# Altium schematic sheet 100_Motor_Mosfet_RGB.SchDoc
size A; SheetNumber: 3; SheetTotal: 4
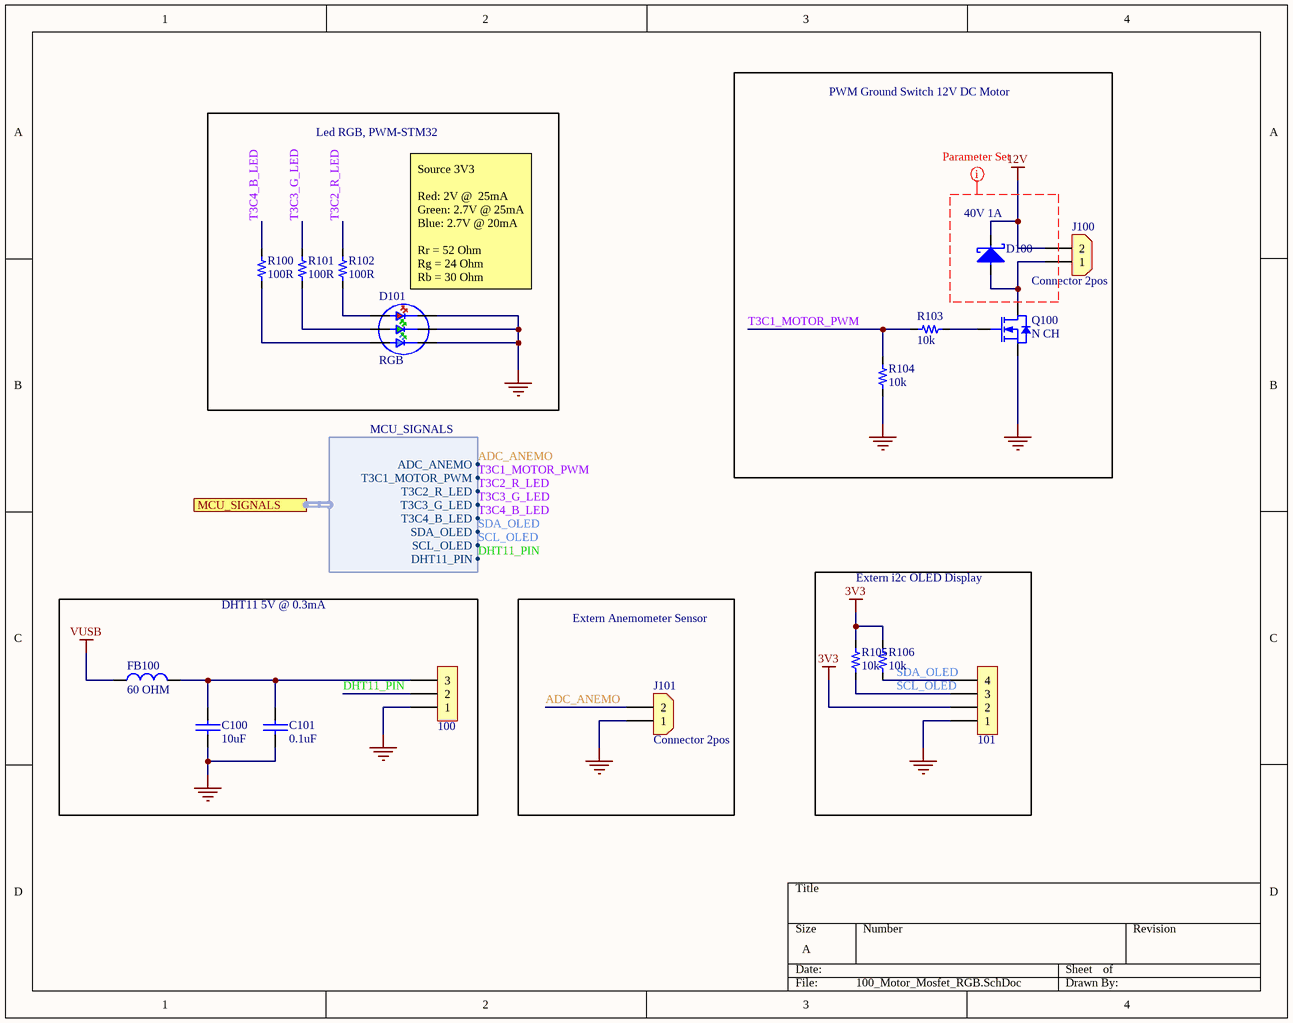
[diagram p0: 100_Motor_Mosfet_RGB.SchDoc]

## Parts
100  3x1  [H_3X1_TH_100mil]  (value not drawn)  (no BOM)
101  4x1  [H_4x1_TH_2.54mm]  (value not drawn)  (no BOM)
C100  value 10uF  [0805_cap]  (hidden comment: 10uF 25V)
C101  value 0.1uF  [0603_cap]  (hidden comment: 0.1uF 50V)
D100  40V 1A  [SOD_123]
D101  RGB  [RGB_NS_3.5X3.7]
FB100  value 60 OHM  [0603_fb]  (hidden comment: 60OHM 2A)
J100  Connector 2pos  [CON_2x1_TH_5MM]
J101  Connector 2pos  [CON_2x1_TH_5MM]
Q100  N CH  [SOT_23_3]
R100  value 100R  [0603_res]  (hidden comment: 100R 1/10W)
R101  value 100R  [0603_res]  (hidden comment: 100R 1/10W)
R102  value 100R  [0603_res]  (hidden comment: 100R 1/10W)
R103  value 10k  [0603_res]  (hidden comment: 10k 1/10W)
R104  value 10k  [0603_res]  (hidden comment: 10k 1/10W)
R105  value 10k  [0603_res]  (hidden comment: 10k 1/10W)
R106  value 10k  [0603_res]  (hidden comment: 10k 1/10W)

## Blocks framed on the sheet
PWM Ground Switch 12V DC Motor: D100 J100 Q100 R103 R104
Led RGB, PWM-STM32: D101 R100-R102
DHT11 5V @ 0.3mA: 100 C100 C101 FB100
Extern Anemometer Sensor: J101
Extern i2c OLED Display: 101 R105 R106

## Ports
MCU_SIGNALS (harness MCU_SIGNALS, see Main[3A], 000_MCUs[2D])

## Harnesses
MCU_SIGNALS: ADC_ANEMO, T3C1_MOTOR_PWM, T3C2_R_LED, T3C3_G_LED, T3C4_B_LED, SDA_OLED, SCL_OLED, DHT11_PIN

## Nets
3V3: 101.2 R105.2 R106.2
12V: D100.1 J100.2
GND: 100.1 101.1 C100.2 C101.2 D101.1 D101.2 D101.3 J101.1 Q100.2(S) R104.1
VUSB: FB100.1
ADC_ANEMO: J101.2 ; port MCU_SIGNALS.ADC_ANEMO
DHT11_PIN: 100.2 ; port MCU_SIGNALS.DHT11_PIN
SCL_OLED: 101.3 R105.1 ; port MCU_SIGNALS.SCL_OLED
SDA_OLED: 101.4 R106.1 ; port MCU_SIGNALS.SDA_OLED
T3C1_MOTOR_PWM: R103.2 R104.2 ; port MCU_SIGNALS.T3C1_MOTOR_PWM
T3C2_R_LED: R102.2 ; port MCU_SIGNALS.T3C2_R_LED
T3C3_G_LED: R101.2 ; port MCU_SIGNALS.T3C3_G_LED
T3C4_B_LED: R100.2 ; port MCU_SIGNALS.T3C4_B_LED
Net100_3: 100.3 C100.1 C101.1 FB100.2
NetD100_2: D100.2 J100.1 Q100.3(D)
NetD101_4: D101.4 R102.1
NetD101_5: D101.5 R101.1
NetD101_6: D101.6 R100.1
NetQ100_1: Q100.1(G) R103.1

## Layout directives
net class 12V_2A: (no net found under the mark)

## Notes on the sheet
- (near D101) Source 3V3
  Red: 2V @  25mA
  Green: 2.7V @ 25mA
  Blue: 2.7V @ 20mA
  Rr = 52 Ohm
  Rg = 24 Ohm
  Rb = 30 Ohm

## Library data of the parts
100 = H_Male_3x1_TH_100mil: ComponentLink1Description: LCSC
101 = H_Male_4x1_TH_100mil: ComponentLink1Description: LCSC
C100 = Cap_10uF_0805_25V_: 25V 10uF X5R ±10% 0805 Multilayer Ceramic Capacitors MLCC - SMD/SMT ROHS; Manufacturer: Samsung Electro-Mechanics; Manufacturer Part Number: CL21A106KAYNNNE; Supplier 1: LCSC; Supplier Part Number 1: C15850; ComponentLink1Description: LCSC; ComponentLink1URL: https://lcsc.com/product-detail/Multilayer-Ceramic-Capacitors-MLCC-SMD-SMT_Samsung-Electro-Mechanics-CL21A106KAYNNNE_C15850.html
C101 = Cap_0.1uF_0603_50V: 50V 100nF Y5V -20%~+80% 0603 Multilayer Ceramic Capacitors MLCC - SMD/SMT ROHS; Manufacturer: Walsin Tech Corp; Manufacturer Part Number: 0603F104Z500CT; Supplier 1: LCSC; Supplier Part Number 1: C83060; ComponentLink1Description: LCSC; ComponentLink1URL: https://www.lcsc.com/product-detail/Multilayer-Ceramic-Capacitors-MLCC-SMD-SMT_Walsin-Tech-Corp-0603F104Z500CT_C83060.html
D100 = D_Schottky_40V_1A_SOD_123F: DIODE SCHOTTKY 40V 1A SOD123F; Manufacturer: Shanghai Prisemi Elec; Manufacturer Part Number: PSBD1DF40V1H; Supplier 1: LCSC; Supplier Part Number 1: C110730; ComponentLink1Description: LCSC; ComponentLink1URL: https://www.lcsc.com/product-detail/Switching-Diode_Shanghai-Prisemi-Elec-PSBD1DF40V1H_C110730.html
D101 = LED_RGB_3535_SMD: -30℃~+85℃ RGB 110° 3535(mm) Light Emitting Diodes (LED) ROHS; Manufacturer: Foshan NationStar Optoelectronics; Manufacturer Part Number: RS-3535MWAM; Supplier 1: LCSC; Supplier Part Number 1: C842778; ComponentLink1Description: LCSC; ComponentLink1URL: https://www.lcsc.com/product-detail/Light-Emitting-Diodes-LED_Foshan-NationStar-Optoelectronics-RS-3535MWAM_C842778.html
FB100 = FB_60_0603_2A: 2A 1 100mΩ 60Ω@100MHz ±25% 0603 Ferrite Beads ROHS; Manufacturer: TAI-TECH; Manufacturer Part Number: HCB1608KF-600T20; ComponentLink1Description: LCSC; ComponentLink1URL: https://www.lcsc.com/product-detail/Ferrite-Beads_TAI-TECH-HCB1608KF-600T20_C369516.html; Supplier 1: LCSC; Supplier Part Number 1: C369516
J100 J101 = Con_2x1_TH_5mm: 2POS 5MM; Manufacturer: JILN; Manufacturer Part Number: JL126-50002G01; Supplier 1: LCSC; Supplier Part Number 1: C394556; ComponentLink1Description: Digi-Key; ComponentLink1URL: https://www.lcsc.com/product-detail/Screw-terminal_JILN-JL126-50002G01_C394556.html
Q100 = Q_NFET_20V_3.2A_SOT23: MOSFET N-CH 20V SOT23; Manufacturer: Doeshare; Manufacturer Part Number: DN2302S; Supplier 1: LCSC; Supplier Part Number 1: C2931750; ComponentLink1Description: LCSC; ComponentLink1URL: https://www.lcsc.com/product-detail/MOSFETs_Doeshare-DN2302S_C2931750.html
R100-R102 = Res_100R_0603_1/10W: RES SMD 100R OHM 5% 1/10W 0603; Manufacturer: FOJAN; Manufacturer Part Number: FRC0603J101 TS; ComponentLink1URL: https://www.lcsc.com/product-detail/Chip-Resistor-Surface-Mount_FOJAN-FRC0603J101-TS_C2907089.html; Supplier 1: LCSC; Supplier Part Number 1: C2907089; ComponentLink1Description: LCSC
R103-R106 = Res_10k_0603_1/10W: RES SMD 10k OHM 5% 1/10W 0603; Manufacturer: FOJAN; Manufacturer Part Number: FRC0603J103TS; ComponentLink1URL: https://www.lcsc.com/product-detail/Chip-Resistor-Surface-Mount_FOJAN-FRC0603J103TS_C2930027.html; Supplier 1: LCSC; Supplier Part Number 1: C2930027; ComponentLink1Description: LCSC